# EasyEDA schematic SCH_Tubeamppedal_2023-06-28 (3).json
TITLE: Tube Amplification Pedal; REV: 1.0; Date: 2023-06-27; Sheet: 1/1; Drawn By: Rishi Nandha V
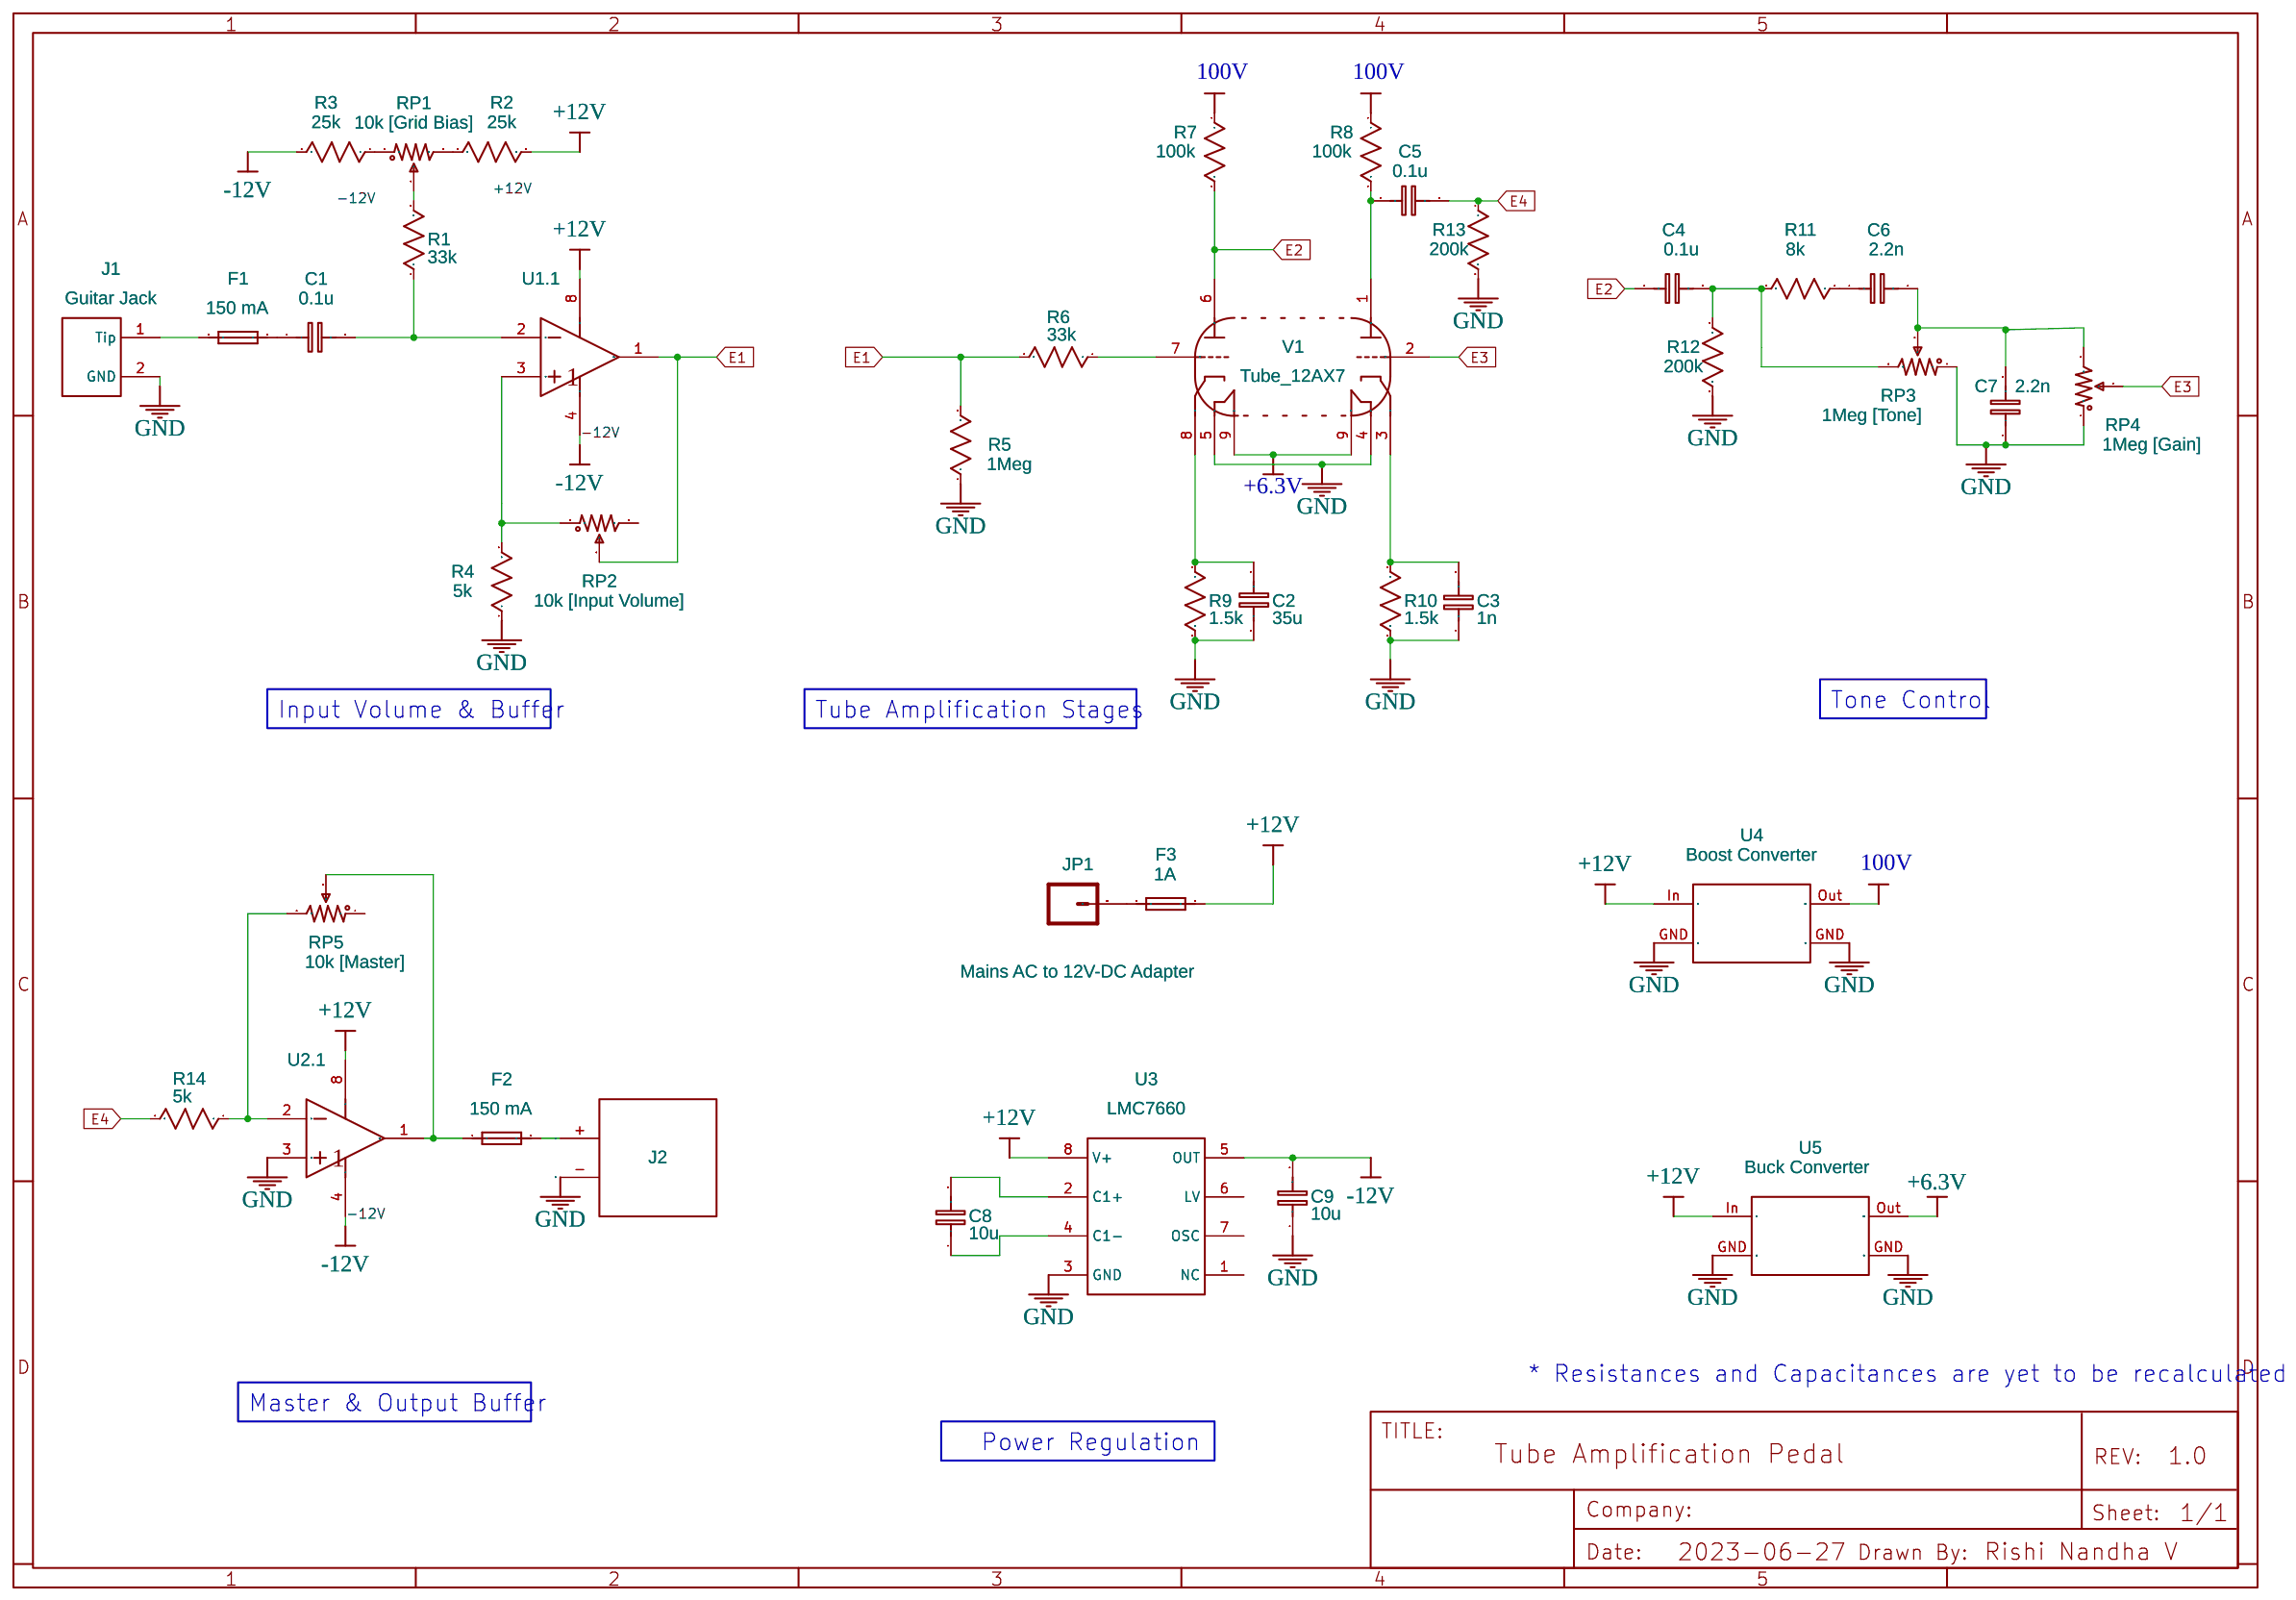
[diagram p0: schematic sheet]

## Parts
C1  0.1u  [C0603]
C2  35u  [C0603]
C3  1n  [C0603]
C4  0.1u  [C0603]
C5  0.1u  [C0603]
C6  2.2n  [C0603]
C7  2.2n  [C0603]
C8  10u  [C0603]
C9  10u  [C0603]
F1  150 mA  [NANO2_SMF_FUSE]
F2  150 mA  [NANO2_SMF_FUSE]
F3  1A  [NANO2_SMF_FUSE]
J1  Guitar Jack  [GUITAR JACK]
J2  Guitar_Jack_Output  [GUITAR_JACK_OUTPUT]
JP1  Mains AC to 12V-DC Adapter  [SPRING-CONNECTOR]
R1  33k  [R0603]
R2  25k  [R0603]
R3  25k  [R0603]
R4  5k  [R0603]
R5  1Meg  [R0603]
R6  33k  [R0603]
R7  100k  [R0603]
R8  100k  [R0603]
R9  1.5k  [R0603]
R10  1.5k  [R0603]
R11  8k  [R0603]
R12  200k  [R0603]
R13  200k  [R0603]
R14  5k  [R0603]
RP1  10k [Grid Bias]  [RES-ADJ-TH_3386P]
RP2  10k [Input Volume]  [RES-ADJ-TH_3386P]
RP3  1Meg [Tone]  [RES-ADJ-TH_3386P]
RP4  1Meg [Gain]  [RES-ADJ-TH_3386P]
RP5  10k [Master]  [RES-ADJ-TH_3386P]
U1  HA7-5102-2  [DIP8]  (section 1)
U2  HA7-5102-2  [DIP8]  (section 1)
U3  LMC7660  [DIP8]
U4  Boost Converter  [SOT-223]
U5  Buck Converter  [SOT-223]
V1  Tube_12AX7  [12AX7]

## Library data of the parts
C1-C9 = C_0603_EU: Contributor: LCEDA_Lib
F1-F3 = NANO2SMF_R452.500L
J1 = Guitar Jack: Contributor: Jose Tovar
J2 = Guitar_Jack_Output: Contributor: ahmits; Package Display: No
JP1 = M01: Contributor: SparkFun
R1-R14 = R_0603_US: Contributor: LCEDA_Lib
RP1-RP5 = R_3386P_US: Supplier: LCSC; Contributor: LCEDA_Lib; value(Ω): 10K
U1 U2 = HA7-5102-2: Low Noise Operational Amplifier; subpart_no: 1
U3 = LMC7660INNOPB: Switched Capacitor Voltage Converter, 8-pin MDIP, Pb-Free
U4 U5 = LM1117IMPX-ADJNOPB: 800mA Low-Dropout Linear Regulator, 4-pin SOT-223, Pb-Free
V1 = Tube_12AX7: High Mu Dual Triode; Contributor: prvi sedmi

## Nets
100V: R7.1 R8.1 U4.Out(OUT)
+6.3V: U5.Out(OUT) V1.9(HM)
+12V: F3.2 R2.2 U1.8(V+) U2.8(V+) U3.8(V+) U4.In(IN) U5.In(IN)
-12V: C9.2 R3.2 U1.4(V-) U2.4(V-) U3.5(OUT)
GND: C2.2 C3.1 C7.1 C9.1 J1.2(GND) R4.1 R5.1 R9.2 R10.2 R12.2 R13.2 RP3.1 RP4.1 U2.3(IN+) U3.3(GND) U4.GND(TAB) U5.GND(TAB) V1.4(H) V1.5(H)
E1: R5.2 R6.2 RP2.2 U1.1(OUT)
E2: C4.1 R7.2 V1.6(PT2)
E3: RP4.2 V1.2(GT1)
E4: C5.2 R13.1 R14.2
Net-(C1-1): C1.1 F1.2
Net-(C1-2): C1.2 R1.1 U1.2(IN-)
Net-(C2-1): C2.1 R9.1 V1.8(KT2)
Net-(C3-2): C3.2 R10.1 V1.3(KT1)
Net-(C4-2): C4.2 R11.2 R12.1 RP3.3
Net-(C5-1): C5.1 R8.2 V1.1(PT1)
Net-(C6-1): C6.1 R11.1
Net-(C6-2): C6.2 C7.2 RP3.2 RP4.3
Net-(C8-1): C8.1 U3.4(C1-)
Net-(C8-2): C8.2 U3.2(C1+)
Net-(F1-1): F1.1 J1.1(Tip)
Net-(F2-1): F2.1 RP5.2 U2.1(OUT)
Net-(F3-1): F3.1 JP1.P$2(1)
Net-(R1-2): R1.2 RP1.2
Net-(R2-1): R2.1 RP1.3
Net-(R3-1): R3.1 RP1.1
Net-(R4-2): R4.2 RP2.1 U1.3(IN+)
Net-(R6-1): R6.1 V1.7(GT2)
Net-(R14-1): R14.1 RP5.3 U2.2(IN-)

Not connected (* = marked no-connect by the designer): F2 2; J2 +(1) -(2); RP2 3; RP5 1; U3 1(NC) 6(LV) 7(OSC)

## Notes on the sheet
- Tone Control
- Input Volume & Buffer
- Tube Amplification Stages
- * Resistances and Capacitances are yet to be recalculated
- Master & Output Buffer
- Power Regulation
